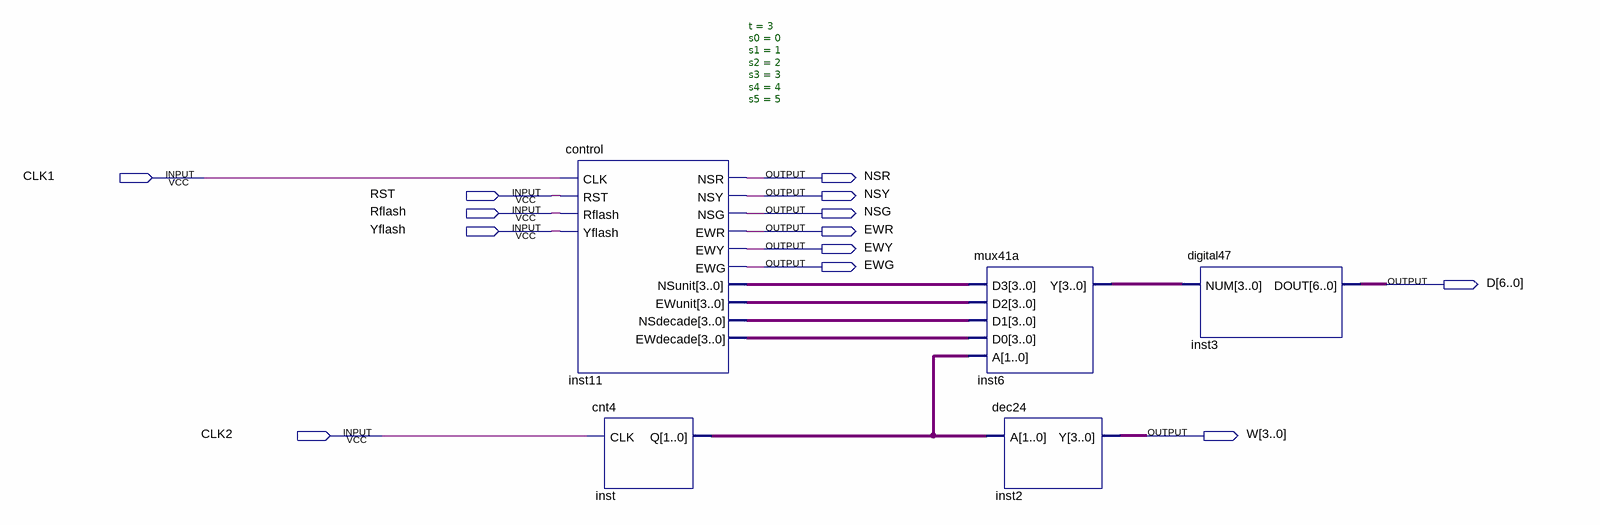
[diagram p0: schematic sheet]
// Quartus schematic fpga.bdf as structural Verilog: 5 symbols, 13 pins
module fpga (
  input  CLK1,
  input  RST,
  input  Rflash,
  input  Yflash,
  input  CLK2,
  output NSR,
  output NSY,
  output NSG,
  output EWR,
  output EWY,
  output EWG,
  output [6:0] D,
  output [3:0] W
);

  wire [1:0] inst_q;
  wire [3:0] inst6_y, inst11_ewdecade, inst11_ewunit, inst11_nsdecade, inst11_nsunit;

  control #(.t(3), .s0(0), .s1(1), .s2(2), .s3(3), .s4(4), .s5(5)) inst11 (
    .CLK(CLK1), .RST(RST), .Rflash(Rflash), .Yflash(Yflash), .NSR(NSR), .NSY(NSY), .NSG(NSG), .EWR(EWR),
    .EWY(EWY), .EWG(EWG), .NSunit(inst11_nsunit), .EWunit(inst11_ewunit), .NSdecade(inst11_nsdecade),
    .EWdecade(inst11_ewdecade));
  cnt4 inst (.CLK(CLK2), .Q(inst_q));
  mux41a inst6 (
    .D3(inst11_nsunit), .D2(inst11_ewunit), .D1(inst11_nsdecade), .D0(inst11_ewdecade), .A(inst_q),
    .Y(inst6_y));
  dec24 inst2 (.A(inst_q), .Y(W));
  digital47 inst3 (.NUM(inst6_y), .DOUT(D));
endmodule
